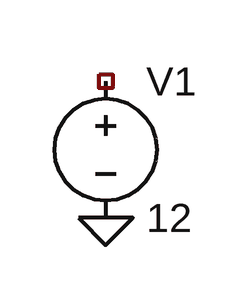
[diagram p0: schematic Creating3V3Line.asc]
Creating3V3Line.asc, the LTspice schematic file:
Version 4.1
SHEET 1 880 680
FLAG -48 128 0
SYMBOL voltage -48 32 R0
WINDOW 123 0 0 Left 0
WINDOW 39 0 0 Left 0
SYMATTR InstName V1
SYMATTR Value 12

The netlist it stands for:
* Creating3V3Line.asc
V1 NC_01 0 12
.backanno
.end